# Altium schematic sheet UVB LED Array.SchDoc: UVB LED Array
size A3; Author: Peake J; CompanyName: Scion Research; DrawnBy: Peake J; Engineer: Peake J; Organization: Scion; Address1: 49 Sala St; Address2: Whakarewarewa; Address3: Rotorua; Address4: New Zealand 3010; DocumentNumber: NA; Revision: 0; SheetNumber: 1; SheetTotal: 1
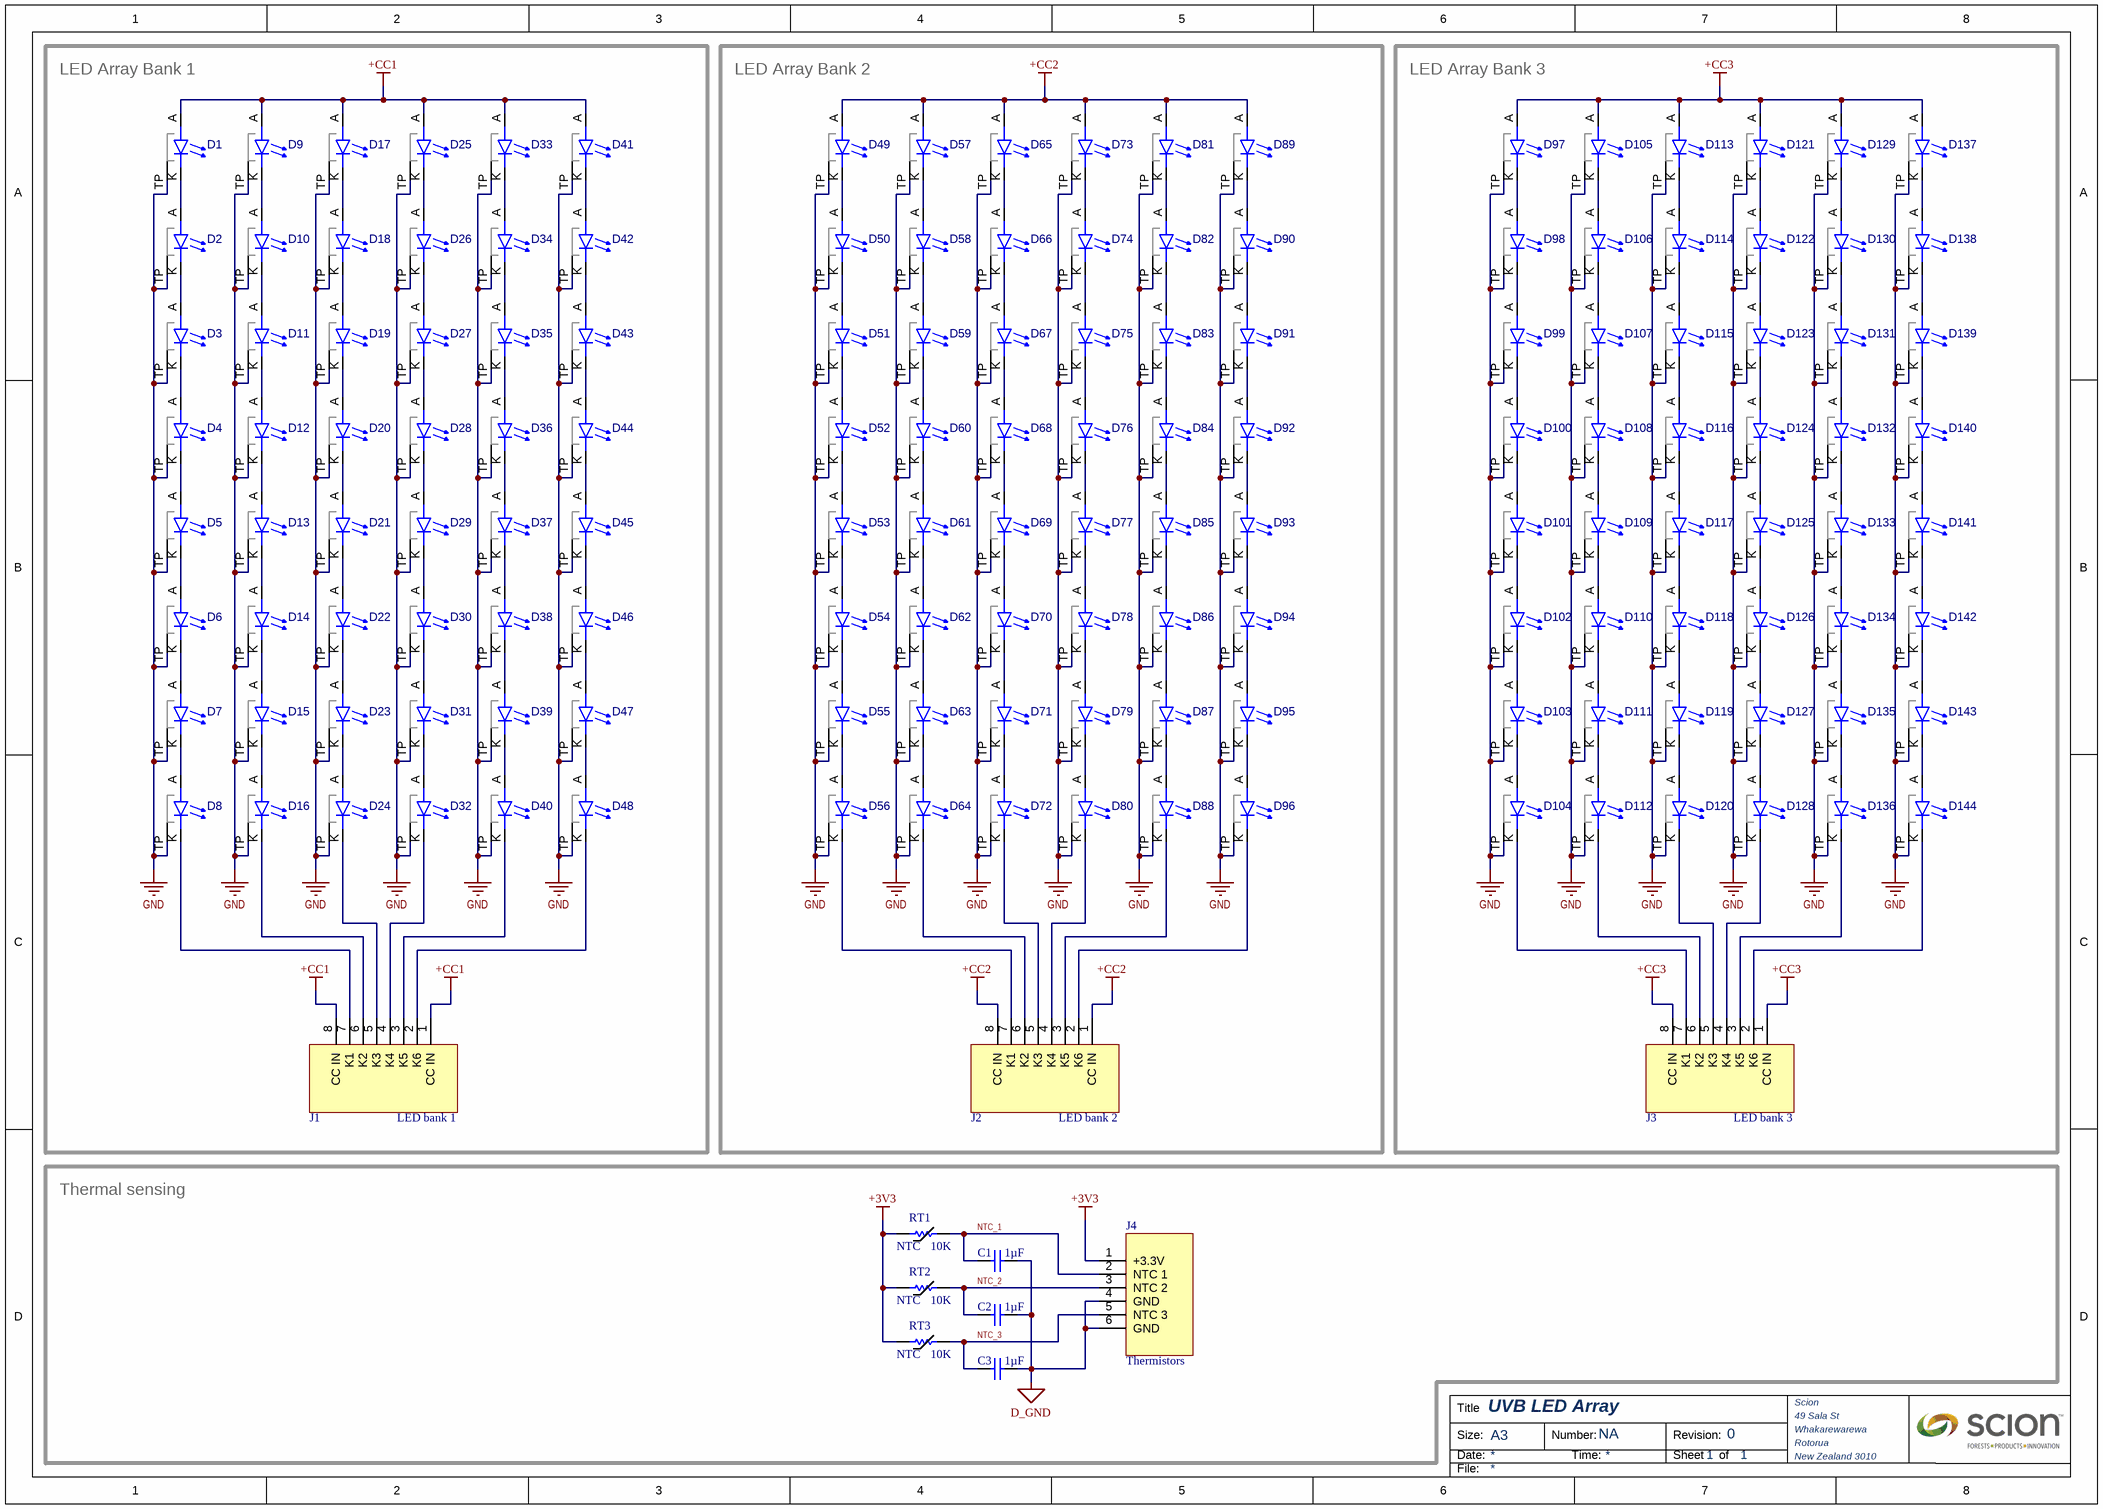
[diagram p0: UVB LED Array.SchDoc]

## Parts
C1  value 1µF  [0603_CAP]  (hidden comment: Capacitor)
C2  value 1µF  [0603_CAP]  (hidden comment: Capacitor)
C3  value 1µF  [0603_CAP]  (hidden comment: Capacitor)
D1  3838UVB UV SMD LED  [3838UVB UV SMD LED-Footprint-1]  (value not drawn)
D2  3838UVB UV SMD LED  [3838UVB UV SMD LED-Footprint-1]  (value not drawn)
D3  3838UVB UV SMD LED  [3838UVB UV SMD LED-Footprint-1]  (value not drawn)
D4  3838UVB UV SMD LED  [3838UVB UV SMD LED-Footprint-1]  (value not drawn)
D5  3838UVB UV SMD LED  [3838UVB UV SMD LED-Footprint-1]  (value not drawn)
D6  3838UVB UV SMD LED  [3838UVB UV SMD LED-Footprint-1]  (value not drawn)
D7  3838UVB UV SMD LED  [3838UVB UV SMD LED-Footprint-1]  (value not drawn)
D8  3838UVB UV SMD LED  [3838UVB UV SMD LED-Footprint-1]  (value not drawn)
D9  3838UVB UV SMD LED  [3838UVB UV SMD LED-Footprint-1]  (value not drawn)
D10  3838UVB UV SMD LED  [3838UVB UV SMD LED-Footprint-1]  (value not drawn)
D11  3838UVB UV SMD LED  [3838UVB UV SMD LED-Footprint-1]  (value not drawn)
D12  3838UVB UV SMD LED  [3838UVB UV SMD LED-Footprint-1]  (value not drawn)
D13  3838UVB UV SMD LED  [3838UVB UV SMD LED-Footprint-1]  (value not drawn)
D14  3838UVB UV SMD LED  [3838UVB UV SMD LED-Footprint-1]  (value not drawn)
D15  3838UVB UV SMD LED  [3838UVB UV SMD LED-Footprint-1]  (value not drawn)
D16  3838UVB UV SMD LED  [3838UVB UV SMD LED-Footprint-1]  (value not drawn)
D17  3838UVB UV SMD LED  [3838UVB UV SMD LED-Footprint-1]  (value not drawn)
D18  3838UVB UV SMD LED  [3838UVB UV SMD LED-Footprint-1]  (value not drawn)
D19  3838UVB UV SMD LED  [3838UVB UV SMD LED-Footprint-1]  (value not drawn)
D20  3838UVB UV SMD LED  [3838UVB UV SMD LED-Footprint-1]  (value not drawn)
D21  3838UVB UV SMD LED  [3838UVB UV SMD LED-Footprint-1]  (value not drawn)
D22  3838UVB UV SMD LED  [3838UVB UV SMD LED-Footprint-1]  (value not drawn)
D23  3838UVB UV SMD LED  [3838UVB UV SMD LED-Footprint-1]  (value not drawn)
D24  3838UVB UV SMD LED  [3838UVB UV SMD LED-Footprint-1]  (value not drawn)
D25  3838UVB UV SMD LED  [3838UVB UV SMD LED-Footprint-1]  (value not drawn)
D26  3838UVB UV SMD LED  [3838UVB UV SMD LED-Footprint-1]  (value not drawn)
D27  3838UVB UV SMD LED  [3838UVB UV SMD LED-Footprint-1]  (value not drawn)
D28  3838UVB UV SMD LED  [3838UVB UV SMD LED-Footprint-1]  (value not drawn)
D29  3838UVB UV SMD LED  [3838UVB UV SMD LED-Footprint-1]  (value not drawn)
D30  3838UVB UV SMD LED  [3838UVB UV SMD LED-Footprint-1]  (value not drawn)
D31  3838UVB UV SMD LED  [3838UVB UV SMD LED-Footprint-1]  (value not drawn)
D32  3838UVB UV SMD LED  [3838UVB UV SMD LED-Footprint-1]  (value not drawn)
D33  3838UVB UV SMD LED  [3838UVB UV SMD LED-Footprint-1]  (value not drawn)
D34  3838UVB UV SMD LED  [3838UVB UV SMD LED-Footprint-1]  (value not drawn)
D35  3838UVB UV SMD LED  [3838UVB UV SMD LED-Footprint-1]  (value not drawn)
D36  3838UVB UV SMD LED  [3838UVB UV SMD LED-Footprint-1]  (value not drawn)
D37  3838UVB UV SMD LED  [3838UVB UV SMD LED-Footprint-1]  (value not drawn)
D38  3838UVB UV SMD LED  [3838UVB UV SMD LED-Footprint-1]  (value not drawn)
D39  3838UVB UV SMD LED  [3838UVB UV SMD LED-Footprint-1]  (value not drawn)
D40  3838UVB UV SMD LED  [3838UVB UV SMD LED-Footprint-1]  (value not drawn)
D41  3838UVB UV SMD LED  [3838UVB UV SMD LED-Footprint-1]  (value not drawn)
D42  3838UVB UV SMD LED  [3838UVB UV SMD LED-Footprint-1]  (value not drawn)
D43  3838UVB UV SMD LED  [3838UVB UV SMD LED-Footprint-1]  (value not drawn)
D44  3838UVB UV SMD LED  [3838UVB UV SMD LED-Footprint-1]  (value not drawn)
D45  3838UVB UV SMD LED  [3838UVB UV SMD LED-Footprint-1]  (value not drawn)
D46  3838UVB UV SMD LED  [3838UVB UV SMD LED-Footprint-1]  (value not drawn)
D47  3838UVB UV SMD LED  [3838UVB UV SMD LED-Footprint-1]  (value not drawn)
D48  3838UVB UV SMD LED  [3838UVB UV SMD LED-Footprint-1]  (value not drawn)
D49  3838UVB UV SMD LED  [3838UVB UV SMD LED-Footprint-1]  (value not drawn)
D50  3838UVB UV SMD LED  [3838UVB UV SMD LED-Footprint-1]  (value not drawn)
D51  3838UVB UV SMD LED  [3838UVB UV SMD LED-Footprint-1]  (value not drawn)
D52  3838UVB UV SMD LED  [3838UVB UV SMD LED-Footprint-1]  (value not drawn)
D53  3838UVB UV SMD LED  [3838UVB UV SMD LED-Footprint-1]  (value not drawn)
D54  3838UVB UV SMD LED  [3838UVB UV SMD LED-Footprint-1]  (value not drawn)
D55  3838UVB UV SMD LED  [3838UVB UV SMD LED-Footprint-1]  (value not drawn)
D56  3838UVB UV SMD LED  [3838UVB UV SMD LED-Footprint-1]  (value not drawn)
D57  3838UVB UV SMD LED  [3838UVB UV SMD LED-Footprint-1]  (value not drawn)
D58  3838UVB UV SMD LED  [3838UVB UV SMD LED-Footprint-1]  (value not drawn)
D59  3838UVB UV SMD LED  [3838UVB UV SMD LED-Footprint-1]  (value not drawn)
D60  3838UVB UV SMD LED  [3838UVB UV SMD LED-Footprint-1]  (value not drawn)
D61  3838UVB UV SMD LED  [3838UVB UV SMD LED-Footprint-1]  (value not drawn)
D62  3838UVB UV SMD LED  [3838UVB UV SMD LED-Footprint-1]  (value not drawn)
D63  3838UVB UV SMD LED  [3838UVB UV SMD LED-Footprint-1]  (value not drawn)
D64  3838UVB UV SMD LED  [3838UVB UV SMD LED-Footprint-1]  (value not drawn)
D65  3838UVB UV SMD LED  [3838UVB UV SMD LED-Footprint-1]  (value not drawn)
D66  3838UVB UV SMD LED  [3838UVB UV SMD LED-Footprint-1]  (value not drawn)
D67  3838UVB UV SMD LED  [3838UVB UV SMD LED-Footprint-1]  (value not drawn)
D68  3838UVB UV SMD LED  [3838UVB UV SMD LED-Footprint-1]  (value not drawn)
D69  3838UVB UV SMD LED  [3838UVB UV SMD LED-Footprint-1]  (value not drawn)
D70  3838UVB UV SMD LED  [3838UVB UV SMD LED-Footprint-1]  (value not drawn)
D71  3838UVB UV SMD LED  [3838UVB UV SMD LED-Footprint-1]  (value not drawn)
D72  3838UVB UV SMD LED  [3838UVB UV SMD LED-Footprint-1]  (value not drawn)
D73  3838UVB UV SMD LED  [3838UVB UV SMD LED-Footprint-1]  (value not drawn)
D74  3838UVB UV SMD LED  [3838UVB UV SMD LED-Footprint-1]  (value not drawn)
D75  3838UVB UV SMD LED  [3838UVB UV SMD LED-Footprint-1]  (value not drawn)
D76  3838UVB UV SMD LED  [3838UVB UV SMD LED-Footprint-1]  (value not drawn)
D77  3838UVB UV SMD LED  [3838UVB UV SMD LED-Footprint-1]  (value not drawn)
D78  3838UVB UV SMD LED  [3838UVB UV SMD LED-Footprint-1]  (value not drawn)
D79  3838UVB UV SMD LED  [3838UVB UV SMD LED-Footprint-1]  (value not drawn)
D80  3838UVB UV SMD LED  [3838UVB UV SMD LED-Footprint-1]  (value not drawn)
D81  3838UVB UV SMD LED  [3838UVB UV SMD LED-Footprint-1]  (value not drawn)
D82  3838UVB UV SMD LED  [3838UVB UV SMD LED-Footprint-1]  (value not drawn)
D83  3838UVB UV SMD LED  [3838UVB UV SMD LED-Footprint-1]  (value not drawn)
D84  3838UVB UV SMD LED  [3838UVB UV SMD LED-Footprint-1]  (value not drawn)
D85  3838UVB UV SMD LED  [3838UVB UV SMD LED-Footprint-1]  (value not drawn)
D86  3838UVB UV SMD LED  [3838UVB UV SMD LED-Footprint-1]  (value not drawn)
D87  3838UVB UV SMD LED  [3838UVB UV SMD LED-Footprint-1]  (value not drawn)
D88  3838UVB UV SMD LED  [3838UVB UV SMD LED-Footprint-1]  (value not drawn)
D89  3838UVB UV SMD LED  [3838UVB UV SMD LED-Footprint-1]  (value not drawn)
D90  3838UVB UV SMD LED  [3838UVB UV SMD LED-Footprint-1]  (value not drawn)
D91  3838UVB UV SMD LED  [3838UVB UV SMD LED-Footprint-1]  (value not drawn)
D92  3838UVB UV SMD LED  [3838UVB UV SMD LED-Footprint-1]  (value not drawn)
D93  3838UVB UV SMD LED  [3838UVB UV SMD LED-Footprint-1]  (value not drawn)
D94  3838UVB UV SMD LED  [3838UVB UV SMD LED-Footprint-1]  (value not drawn)
D95  3838UVB UV SMD LED  [3838UVB UV SMD LED-Footprint-1]  (value not drawn)
D96  3838UVB UV SMD LED  [3838UVB UV SMD LED-Footprint-1]  (value not drawn)
D97  3838UVB UV SMD LED  [3838UVB UV SMD LED-Footprint-1]  (value not drawn)
D98  3838UVB UV SMD LED  [3838UVB UV SMD LED-Footprint-1]  (value not drawn)
D99  3838UVB UV SMD LED  [3838UVB UV SMD LED-Footprint-1]  (value not drawn)
D100  3838UVB UV SMD LED  [3838UVB UV SMD LED-Footprint-1]  (value not drawn)
D101  3838UVB UV SMD LED  [3838UVB UV SMD LED-Footprint-1]  (value not drawn)
D102  3838UVB UV SMD LED  [3838UVB UV SMD LED-Footprint-1]  (value not drawn)
D103  3838UVB UV SMD LED  [3838UVB UV SMD LED-Footprint-1]  (value not drawn)
D104  3838UVB UV SMD LED  [3838UVB UV SMD LED-Footprint-1]  (value not drawn)
D105  3838UVB UV SMD LED  [3838UVB UV SMD LED-Footprint-1]  (value not drawn)
D106  3838UVB UV SMD LED  [3838UVB UV SMD LED-Footprint-1]  (value not drawn)
D107  3838UVB UV SMD LED  [3838UVB UV SMD LED-Footprint-1]  (value not drawn)
D108  3838UVB UV SMD LED  [3838UVB UV SMD LED-Footprint-1]  (value not drawn)
D109  3838UVB UV SMD LED  [3838UVB UV SMD LED-Footprint-1]  (value not drawn)
D110  3838UVB UV SMD LED  [3838UVB UV SMD LED-Footprint-1]  (value not drawn)
D111  3838UVB UV SMD LED  [3838UVB UV SMD LED-Footprint-1]  (value not drawn)
D112  3838UVB UV SMD LED  [3838UVB UV SMD LED-Footprint-1]  (value not drawn)
D113  3838UVB UV SMD LED  [3838UVB UV SMD LED-Footprint-1]  (value not drawn)
D114  3838UVB UV SMD LED  [3838UVB UV SMD LED-Footprint-1]  (value not drawn)
D115  3838UVB UV SMD LED  [3838UVB UV SMD LED-Footprint-1]  (value not drawn)
D116  3838UVB UV SMD LED  [3838UVB UV SMD LED-Footprint-1]  (value not drawn)
D117  3838UVB UV SMD LED  [3838UVB UV SMD LED-Footprint-1]  (value not drawn)
D118  3838UVB UV SMD LED  [3838UVB UV SMD LED-Footprint-1]  (value not drawn)
D119  3838UVB UV SMD LED  [3838UVB UV SMD LED-Footprint-1]  (value not drawn)
D120  3838UVB UV SMD LED  [3838UVB UV SMD LED-Footprint-1]  (value not drawn)
D121  3838UVB UV SMD LED  [3838UVB UV SMD LED-Footprint-1]  (value not drawn)
D122  3838UVB UV SMD LED  [3838UVB UV SMD LED-Footprint-1]  (value not drawn)
D123  3838UVB UV SMD LED  [3838UVB UV SMD LED-Footprint-1]  (value not drawn)
D124  3838UVB UV SMD LED  [3838UVB UV SMD LED-Footprint-1]  (value not drawn)
D125  3838UVB UV SMD LED  [3838UVB UV SMD LED-Footprint-1]  (value not drawn)
D126  3838UVB UV SMD LED  [3838UVB UV SMD LED-Footprint-1]  (value not drawn)
D127  3838UVB UV SMD LED  [3838UVB UV SMD LED-Footprint-1]  (value not drawn)
D128  3838UVB UV SMD LED  [3838UVB UV SMD LED-Footprint-1]  (value not drawn)
D129  3838UVB UV SMD LED  [3838UVB UV SMD LED-Footprint-1]  (value not drawn)
D130  3838UVB UV SMD LED  [3838UVB UV SMD LED-Footprint-1]  (value not drawn)
D131  3838UVB UV SMD LED  [3838UVB UV SMD LED-Footprint-1]  (value not drawn)
D132  3838UVB UV SMD LED  [3838UVB UV SMD LED-Footprint-1]  (value not drawn)
D133  3838UVB UV SMD LED  [3838UVB UV SMD LED-Footprint-1]  (value not drawn)
D134  3838UVB UV SMD LED  [3838UVB UV SMD LED-Footprint-1]  (value not drawn)
D135  3838UVB UV SMD LED  [3838UVB UV SMD LED-Footprint-1]  (value not drawn)
D136  3838UVB UV SMD LED  [3838UVB UV SMD LED-Footprint-1]  (value not drawn)
D137  3838UVB UV SMD LED  [3838UVB UV SMD LED-Footprint-1]  (value not drawn)
D138  3838UVB UV SMD LED  [3838UVB UV SMD LED-Footprint-1]  (value not drawn)
D139  3838UVB UV SMD LED  [3838UVB UV SMD LED-Footprint-1]  (value not drawn)
D140  3838UVB UV SMD LED  [3838UVB UV SMD LED-Footprint-1]  (value not drawn)
D141  3838UVB UV SMD LED  [3838UVB UV SMD LED-Footprint-1]  (value not drawn)
D142  3838UVB UV SMD LED  [3838UVB UV SMD LED-Footprint-1]  (value not drawn)
D143  3838UVB UV SMD LED  [3838UVB UV SMD LED-Footprint-1]  (value not drawn)
D144  3838UVB UV SMD LED  [3838UVB UV SMD LED-Footprint-1]  (value not drawn)
J1  LED bank 1  [8P Clik-MATE 1.5mm INVERTED]
J2  LED bank 2  [8P Clik-MATE 1.5mm INVERTED]
J3  LED bank 3  [8P Clik-MATE 1.5mm INVERTED]
J4  Thermistors  [6P Clik-MATE 1.5mm INVERTED]
RT1  NTC  value 10K  [0603_THERM]
RT2  NTC  value 10K  [0603_THERM]
RT3  NTC  value 10K  [0603_THERM]

## Blocks framed on the sheet
LED Array Bank 1: D1-D48 J1
LED Array Bank 2: D49-D96 J2
LED Array Bank 3: D97-D144 J3
Thermal sensing: C1-C3 J4 RT1-RT3

## Nets
+3V3: J4.1(+3.3V) RT1.1 RT2.1 RT3.1
+CC1: D1.A D9.A D17.A D25.A D33.A D41.A J1.1(CC_IN) J1.8(CC_IN)
+CC2: D49.A D57.A D65.A D73.A D81.A D89.A J2.1(CC_IN) J2.8(CC_IN)
+CC3: D97.A D105.A D113.A D121.A D129.A D137.A J3.1(CC_IN) J3.8(CC_IN)
D_GND: C1.1 C2.1 C3.1 J4.4(GND) J4.6(GND)
GND: D1.TP(Pad) D2.TP(Pad) D3.TP(Pad) D4.TP(Pad) D5.TP(Pad) D6.TP(Pad) D7.TP(Pad) D8.TP(Pad) D9.TP(Pad) D10.TP(Pad) D11.TP(Pad) D12.TP(Pad) D13.TP(Pad) D14.TP(Pad) D15.TP(Pad) D16.TP(Pad) D17.TP(Pad) D18.TP(Pad) D19.TP(Pad) D20.TP(Pad) D21.TP(Pad) D22.TP(Pad) D23.TP(Pad) D24.TP(Pad) D25.TP(Pad) D26.TP(Pad) D27.TP(Pad) D28.TP(Pad) D29.TP(Pad) D30.TP(Pad) D31.TP(Pad) D32.TP(Pad) D33.TP(Pad) D34.TP(Pad) D35.TP(Pad) D36.TP(Pad) D37.TP(Pad) D38.TP(Pad) D39.TP(Pad) D40.TP(Pad) D41.TP(Pad) D42.TP(Pad) D43.TP(Pad) D44.TP(Pad) D45.TP(Pad) D46.TP(Pad) D47.TP(Pad) D48.TP(Pad) D49.TP(Pad) D50.TP(Pad) D51.TP(Pad) D52.TP(Pad) D53.TP(Pad) D54.TP(Pad) D55.TP(Pad) D56.TP(Pad) D57.TP(Pad) D58.TP(Pad) D59.TP(Pad) D60.TP(Pad) D61.TP(Pad) D62.TP(Pad) D63.TP(Pad) D64.TP(Pad) D65.TP(Pad) D66.TP(Pad) D67.TP(Pad) D68.TP(Pad) D69.TP(Pad) D70.TP(Pad) D71.TP(Pad) D72.TP(Pad) D73.TP(Pad) D74.TP(Pad) D75.TP(Pad) D76.TP(Pad) D77.TP(Pad) D78.TP(Pad) D79.TP(Pad) D80.TP(Pad) D81.TP(Pad) D82.TP(Pad) D83.TP(Pad) D84.TP(Pad) D85.TP(Pad) D86.TP(Pad) D87.TP(Pad) D88.TP(Pad) D89.TP(Pad) D90.TP(Pad) D91.TP(Pad) D92.TP(Pad) D93.TP(Pad) D94.TP(Pad) D95.TP(Pad) D96.TP(Pad) D97.TP(Pad) D98.TP(Pad) D99.TP(Pad) D100.TP(Pad) D101.TP(Pad) D102.TP(Pad) D103.TP(Pad) D104.TP(Pad) D105.TP(Pad) D106.TP(Pad) D107.TP(Pad) D108.TP(Pad) D109.TP(Pad) D110.TP(Pad) D111.TP(Pad) D112.TP(Pad) D113.TP(Pad) D114.TP(Pad) D115.TP(Pad) D116.TP(Pad) D117.TP(Pad) D118.TP(Pad) D119.TP(Pad) D120.TP(Pad) D121.TP(Pad) D122.TP(Pad) D123.TP(Pad) D124.TP(Pad) D125.TP(Pad) D126.TP(Pad) D127.TP(Pad) D128.TP(Pad) D129.TP(Pad) D130.TP(Pad) D131.TP(Pad) D132.TP(Pad) D133.TP(Pad) D134.TP(Pad) D135.TP(Pad) D136.TP(Pad) D137.TP(Pad) D138.TP(Pad) D139.TP(Pad) D140.TP(Pad) D141.TP(Pad) D142.TP(Pad) D143.TP(Pad) D144.TP(Pad)
NTC_1: C1.2 J4.2(NTC_1) RT1.2
NTC_2: C2.2 J4.3(NTC_2) RT2.2
NTC_3: C3.2 J4.5(NTC_3) RT3.2
NetD1_K: D1.K D2.A
NetD2_K: D2.K D3.A
NetD3_K: D3.K D4.A
NetD4_K: D4.K D5.A
NetD5_K: D5.K D6.A
NetD6_K: D6.K D7.A
NetD7_K: D7.K D8.A
NetD8_K: D8.K J1.7(K1)
NetD9_K: D9.K D10.A
NetD10_K: D10.K D11.A
NetD11_K: D11.K D12.A
NetD12_K: D12.K D13.A
NetD13_K: D13.K D14.A
NetD14_K: D14.K D15.A
NetD15_K: D15.K D16.A
NetD16_K: D16.K J1.6(K2)
NetD17_K: D17.K D18.A
NetD18_K: D18.K D19.A
NetD19_K: D19.K D20.A
NetD20_K: D20.K D21.A
NetD21_K: D21.K D22.A
NetD22_K: D22.K D23.A
NetD23_K: D23.K D24.A
NetD24_K: D24.K J1.5(K3)
NetD25_K: D25.K D26.A
NetD26_K: D26.K D27.A
NetD27_K: D27.K D28.A
NetD28_K: D28.K D29.A
NetD29_K: D29.K D30.A
NetD30_K: D30.K D31.A
NetD31_K: D31.K D32.A
NetD32_K: D32.K J1.4(K4)
NetD33_K: D33.K D34.A
NetD34_K: D34.K D35.A
NetD35_K: D35.K D36.A
NetD36_K: D36.K D37.A
NetD37_K: D37.K D38.A
NetD38_K: D38.K D39.A
NetD39_K: D39.K D40.A
NetD40_K: D40.K J1.3(K5)
NetD41_K: D41.K D42.A
NetD42_K: D42.K D43.A
NetD43_K: D43.K D44.A
NetD44_K: D44.K D45.A
NetD45_K: D45.K D46.A
NetD46_K: D46.K D47.A
NetD47_K: D47.K D48.A
NetD48_K: D48.K J1.2(K6)
NetD49_K: D49.K D50.A
NetD50_K: D50.K D51.A
NetD51_K: D51.K D52.A
NetD52_K: D52.K D53.A
NetD53_K: D53.K D54.A
NetD54_K: D54.K D55.A
NetD55_K: D55.K D56.A
NetD56_K: D56.K J2.7(K1)
NetD57_K: D57.K D58.A
NetD58_K: D58.K D59.A
NetD59_K: D59.K D60.A
NetD60_K: D60.K D61.A
NetD61_K: D61.K D62.A
NetD62_K: D62.K D63.A
NetD63_K: D63.K D64.A
NetD64_K: D64.K J2.6(K2)
NetD65_K: D65.K D66.A
NetD66_K: D66.K D67.A
NetD67_K: D67.K D68.A
NetD68_K: D68.K D69.A
NetD69_K: D69.K D70.A
NetD70_K: D70.K D71.A
NetD71_K: D71.K D72.A
NetD72_K: D72.K J2.5(K3)
NetD73_K: D73.K D74.A
NetD74_K: D74.K D75.A
NetD75_K: D75.K D76.A
NetD76_K: D76.K D77.A
NetD77_K: D77.K D78.A
NetD78_K: D78.K D79.A
NetD79_K: D79.K D80.A
NetD80_K: D80.K J2.4(K4)
NetD81_K: D81.K D82.A
NetD82_K: D82.K D83.A
NetD83_K: D83.K D84.A
NetD84_K: D84.K D85.A
NetD85_K: D85.K D86.A
NetD86_K: D86.K D87.A
NetD87_K: D87.K D88.A
NetD88_K: D88.K J2.3(K5)
NetD89_K: D89.K D90.A
NetD90_K: D90.K D91.A
NetD91_K: D91.K D92.A
NetD92_K: D92.K D93.A
NetD93_K: D93.K D94.A
NetD94_K: D94.K D95.A
NetD95_K: D95.K D96.A
NetD96_K: D96.K J2.2(K6)
NetD97_K: D97.K D98.A
NetD98_K: D98.K D99.A
NetD99_K: D99.K D100.A
NetD100_K: D100.K D101.A
NetD101_K: D101.K D102.A
NetD102_K: D102.K D103.A
NetD103_K: D103.K D104.A
NetD104_K: D104.K J3.7(K1)
NetD105_K: D105.K D106.A
NetD106_K: D106.K D107.A
NetD107_K: D107.K D108.A
NetD108_K: D108.K D109.A
NetD109_K: D109.K D110.A
NetD110_K: D110.K D111.A
NetD111_K: D111.K D112.A
NetD112_K: D112.K J3.6(K2)
NetD113_K: D113.K D114.A
NetD114_K: D114.K D115.A
NetD115_K: D115.K D116.A
NetD116_K: D116.K D117.A
NetD117_K: D117.K D118.A
NetD118_K: D118.K D119.A
NetD119_K: D119.K D120.A
NetD120_K: D120.K J3.5(K3)
NetD121_K: D121.K D122.A
NetD122_K: D122.K D123.A
NetD123_K: D123.K D124.A
NetD124_K: D124.K D125.A
NetD125_K: D125.K D126.A
NetD126_K: D126.K D127.A
NetD127_K: D127.K D128.A
NetD128_K: D128.K J3.4(K4)
NetD129_K: D129.K D130.A
NetD130_K: D130.K D131.A
NetD131_K: D131.K D132.A
NetD132_K: D132.K D133.A
NetD133_K: D133.K D134.A
NetD134_K: D134.K D135.A
NetD135_K: D135.K D136.A
NetD136_K: D136.K J3.3(K5)
NetD137_K: D137.K D138.A
NetD138_K: D138.K D139.A
NetD139_K: D139.K D140.A
NetD140_K: D140.K D141.A
NetD141_K: D141.K D142.A
NetD142_K: D142.K D143.A
NetD143_K: D143.K D144.A
NetD144_K: D144.K J3.2(K6)

## Notes on the sheet
- Title
- Size:
- Date:
- A3
- Number:
- Time:
- Revision:
- Sheet
- of
- File:

## Library data of the parts
C1-C3 = CMP-001-00172-2: SMD Capacitor; Pins: 2; Source: Discrete.SchLib; Design Item ID: Capacitor; Component Type: Standard
D1-D144 = CMP-007-00000-1
J1-J3 = CMP-002-00183-2: 8 Pin Connector; Pin Count: 8; Design Item ID: 8_Pin; Component Type: Standard; Pins: 8; Source: Connectors.SchLib
J4 = CMP-002-00180-3: 6 Pin Connector; Pins: 6; Component Type: Standard; Pin Count: 6; Design Item ID: 6_Pin; Source: Connectors.SchLib
RT1-RT3 = CMP-079-000106-1: Thermistor; Max Power: 100mW; B-Constant: 3930; Source: Discrete.SchLib; Design Item ID: Thermistor; Component Type: Standard; Pin Count: 2